# Altium schematic sheet schemBEATRIX.SchDoc
size A4; SheetNumber: 1; SheetTotal: 1
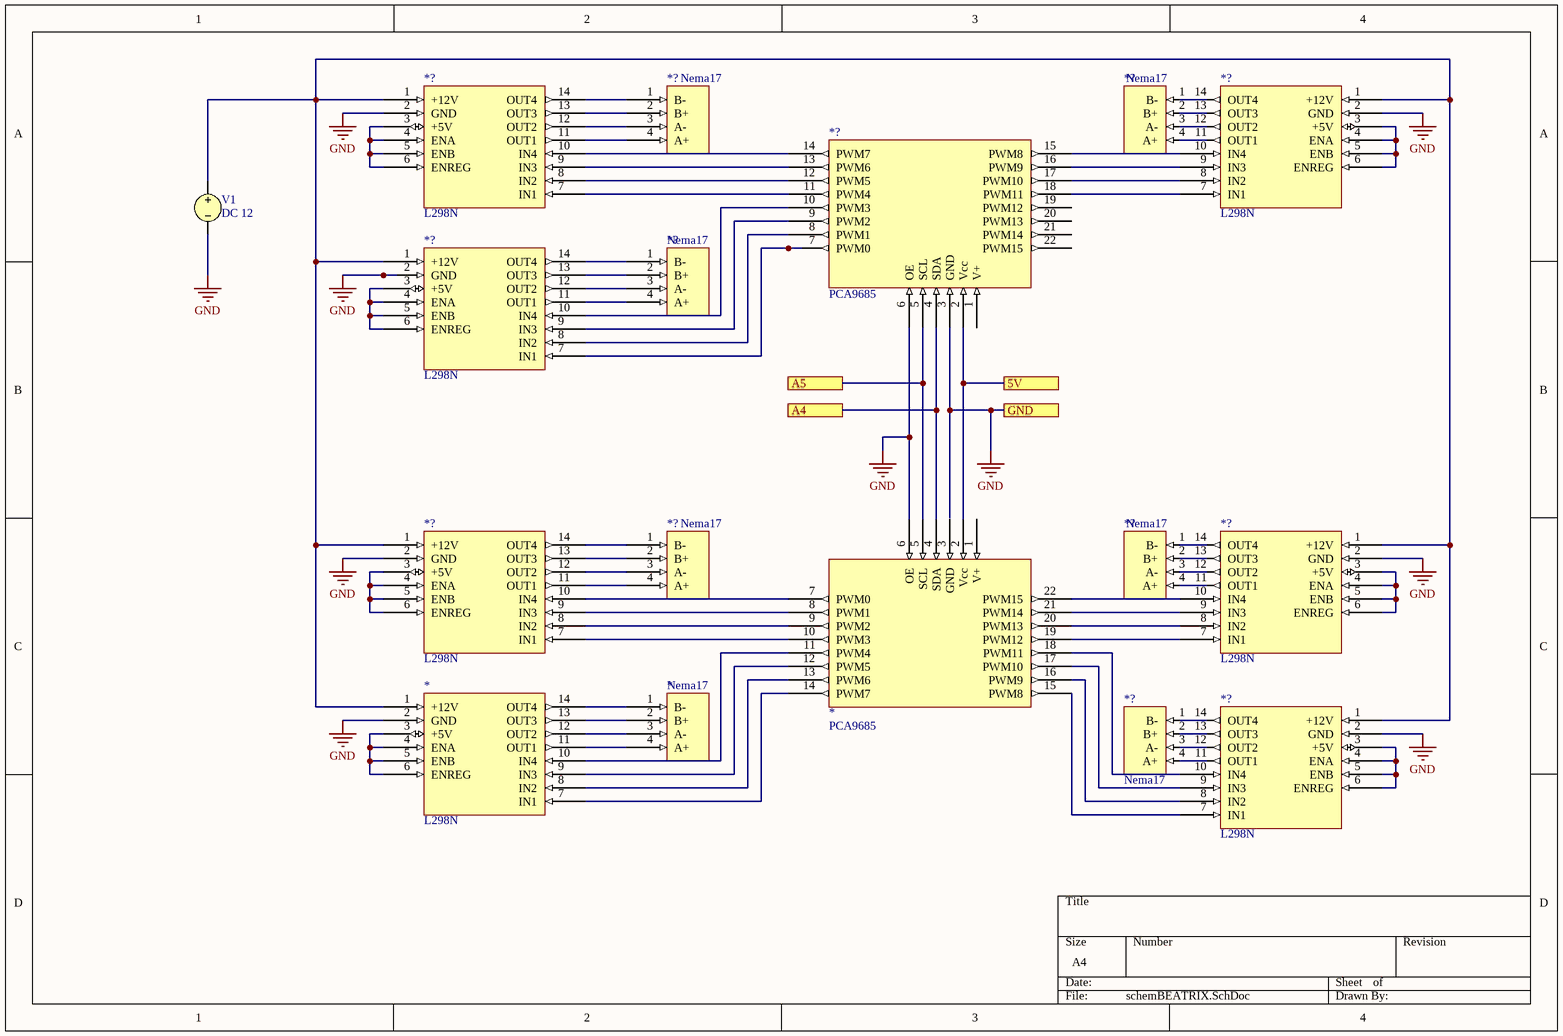
[diagram p0: schemBEATRIX.SchDoc]

## Parts
(Parts that share a designator on the sheet are numbered #1, #2 ... from top to bottom, then left to right.)
*#1  PCA9685
*#2  L298N
*#3  Nema17
*?#1  L298N
*?#2  Nema17
*?#3  Nema17
*?#4  L298N
*?#5  PCA9685
*?#6  L298N
*?#7  Nema17
*?#8  L298N
*?#9  Nema17
*?#10  Nema17
*?#11  L298N
*?#12  Nema17
*?#13  L298N
V1  DC 12

## Ports
5V, A4, A5, GND

## Nets
GND: *#1.6(OE) *#2.2(GND) *?#1.2(GND) *?#4.2(GND) *?#5.3(GND) *?#5.6(OE) *?#6.2(GND) *?#8.2(GND) *?#11.2(GND) *?#13.2(GND) V1.2 ; port GND
5V: *#1.2(Vcc) *?#5.2(Vcc) ; port 5V
A4: *#1.4(SDA) *?#5.4(SDA) ; port A4
A5: *#1.5(SCL) *?#5.5(SCL) ; port A5
Net*#1_7: *#1.7(PWM0) *?#8.10(IN4)
Net*#1_8: *#1.8(PWM1) *?#8.9(IN3)
Net*#1_9: *#1.9(PWM2) *?#8.8(IN2)
Net*#1_10: *#1.10(PWM3) *?#8.7(IN1)
Net*#1_11: *#1.11(PWM4) *#2.10(IN4)
Net*#1_12: *#1.12(PWM5) *#2.9(IN3)
Net*#1_13: *#1.13(PWM6) *#2.8(IN2)
Net*#1_14: *#1.14(PWM7) *#2.7(IN1)
Net*#1_15: *#1.15(PWM8) *?#13.7(IN1)
Net*#1_16: *#1.16(PWM9) *?#13.8(IN2)
Net*#1_17: *#1.17(PWM10) *?#13.9(IN3)
Net*#1_18: *#1.18(PWM11) *?#13.10(IN4)
Net*#1_19: *#1.19(PWM12) *?#11.7(IN1)
Net*#1_20: *#1.20(PWM13) *?#11.8(IN2)
Net*#1_21: *#1.21(PWM14) *?#11.9(IN3)
Net*#1_22: *#1.22(PWM15) *?#11.10(IN4)
Net*#2_1: *#2.1(+12V) *?#1.1(+12V) *?#4.1(+12V) *?#6.1(+12V) *?#8.1(+12V) *?#11.1(+12V) *?#13.1(+12V) V1.1
Net*#2_3: *#2.3(+5V) *#2.4(ENA) *#2.5(ENB) *#2.6(ENREG)
Net*#2_11: *#2.11(OUT1) *#3.4(A+)
Net*#2_12: *#2.12(OUT2) *#3.3(A-)
Net*#2_13: *#2.13(OUT3) *#3.2(B+)
Net*#2_14: *#2.14(OUT4) *#3.1(B-)
Net*?#1_3: *?#1.3(+5V) *?#1.4(ENA) *?#1.5(ENB) *?#1.6(ENREG)
Net*?#1_7: *?#1.7(IN1) *?#5.11(PWM4)
Net*?#1_8: *?#1.8(IN2) *?#5.12(PWM5)
Net*?#1_9: *?#1.9(IN3) *?#5.13(PWM6)
Net*?#1_10: *?#1.10(IN4) *?#5.14(PWM7)
Net*?#1_11: *?#1.11(OUT1) *?#2.4(A+)
Net*?#1_12: *?#1.12(OUT2) *?#2.3(A-)
Net*?#1_13: *?#1.13(OUT3) *?#2.2(B+)
Net*?#1_14: *?#1.14(OUT4) *?#2.1(B-)
Net*?#3_1: *?#3.1(B-) *?#4.14(OUT4)
Net*?#3_2: *?#3.2(B+) *?#4.13(OUT3)
Net*?#3_3: *?#3.3(A-) *?#4.12(OUT2)
Net*?#3_4: *?#3.4(A+) *?#4.11(OUT1)
Net*?#4_3: *?#4.3(+5V) *?#4.4(ENA) *?#4.5(ENB) *?#4.6(ENREG)
Net*?#4_7: *?#4.7(IN1) *?#5.18(PWM11)
Net*?#4_8: *?#4.8(IN2) *?#5.17(PWM10)
Net*?#4_9: *?#4.9(IN3) *?#5.16(PWM9)
Net*?#4_10: *?#4.10(IN4) *?#5.15(PWM8)
Net*?#5_7: *?#5.7(PWM0) *?#6.7(IN1)
Net*?#5_8: *?#5.8(PWM1) *?#6.8(IN2)
Net*?#5_9: *?#5.9(PWM2) *?#6.9(IN3)
Net*?#5_10: *?#5.10(PWM3) *?#6.10(IN4)
Net*?#6_3: *?#6.3(+5V) *?#6.4(ENA) *?#6.5(ENB) *?#6.6(ENREG)
Net*?#6_11: *?#6.11(OUT1) *?#7.4(A+)
Net*?#6_12: *?#6.12(OUT2) *?#7.3(A-)
Net*?#6_13: *?#6.13(OUT3) *?#7.2(B+)
Net*?#6_14: *?#6.14(OUT4) *?#7.1(B-)
Net*?#8_3: *?#8.3(+5V) *?#8.4(ENA) *?#8.5(ENB) *?#8.6(ENREG)
Net*?#8_11: *?#8.11(OUT1) *?#9.4(A+)
Net*?#8_12: *?#8.12(OUT2) *?#9.3(A-)
Net*?#8_13: *?#8.13(OUT3) *?#9.2(B+)
Net*?#8_14: *?#8.14(OUT4) *?#9.1(B-)
Net*?#10_1: *?#10.1(B-) *?#11.14(OUT4)
Net*?#10_2: *?#10.2(B+) *?#11.13(OUT3)
Net*?#10_3: *?#10.3(A-) *?#11.12(OUT2)
Net*?#10_4: *?#10.4(A+) *?#11.11(OUT1)
Net*?#11_3: *?#11.3(+5V) *?#11.4(ENA) *?#11.5(ENB) *?#11.6(ENREG)
Net*?#12_1: *?#12.1(B-) *?#13.14(OUT4)
Net*?#12_2: *?#12.2(B+) *?#13.13(OUT3)
Net*?#12_3: *?#12.3(A-) *?#13.12(OUT2)
Net*?#12_4: *?#12.4(A+) *?#13.11(OUT1)
Net*?#13_3: *?#13.3(+5V) *?#13.4(ENA) *?#13.5(ENB) *?#13.6(ENREG)

Not connected (* = marked no-connect by the designer): *#1 1(V+) 3(GND); *?#5 1(V+) 19(PWM12) 20(PWM13) 21(PWM14) 22(PWM15)

## Library data of the parts
*#1 *?#5 = CMP-00024-00007-2: i2c PWM signal generator
*#2 *?#1 *?#4 *?#6 *?#8 *?#11 *?#13 = CMP-00024-00006-3: Motor Driver Breakout Board
*#3 *?#2 *?#3 *?#7 *?#9 *?#10 *?#12 = CMP-00028-00007-3: Nema17 Stepper Motor
V1 = VSRC: Voltage Source; Note: PCB Footprint - Not required; AC Magnitude: 1; AC Phase: 0; Value: 12; Published: 8-Jun-2000; LatestRevisionDate: 17-Jul-2002; LatestRevisionNote: Re-released for DXP Platform.; PackageReference: Not Applicable; Publisher: Altium Limited